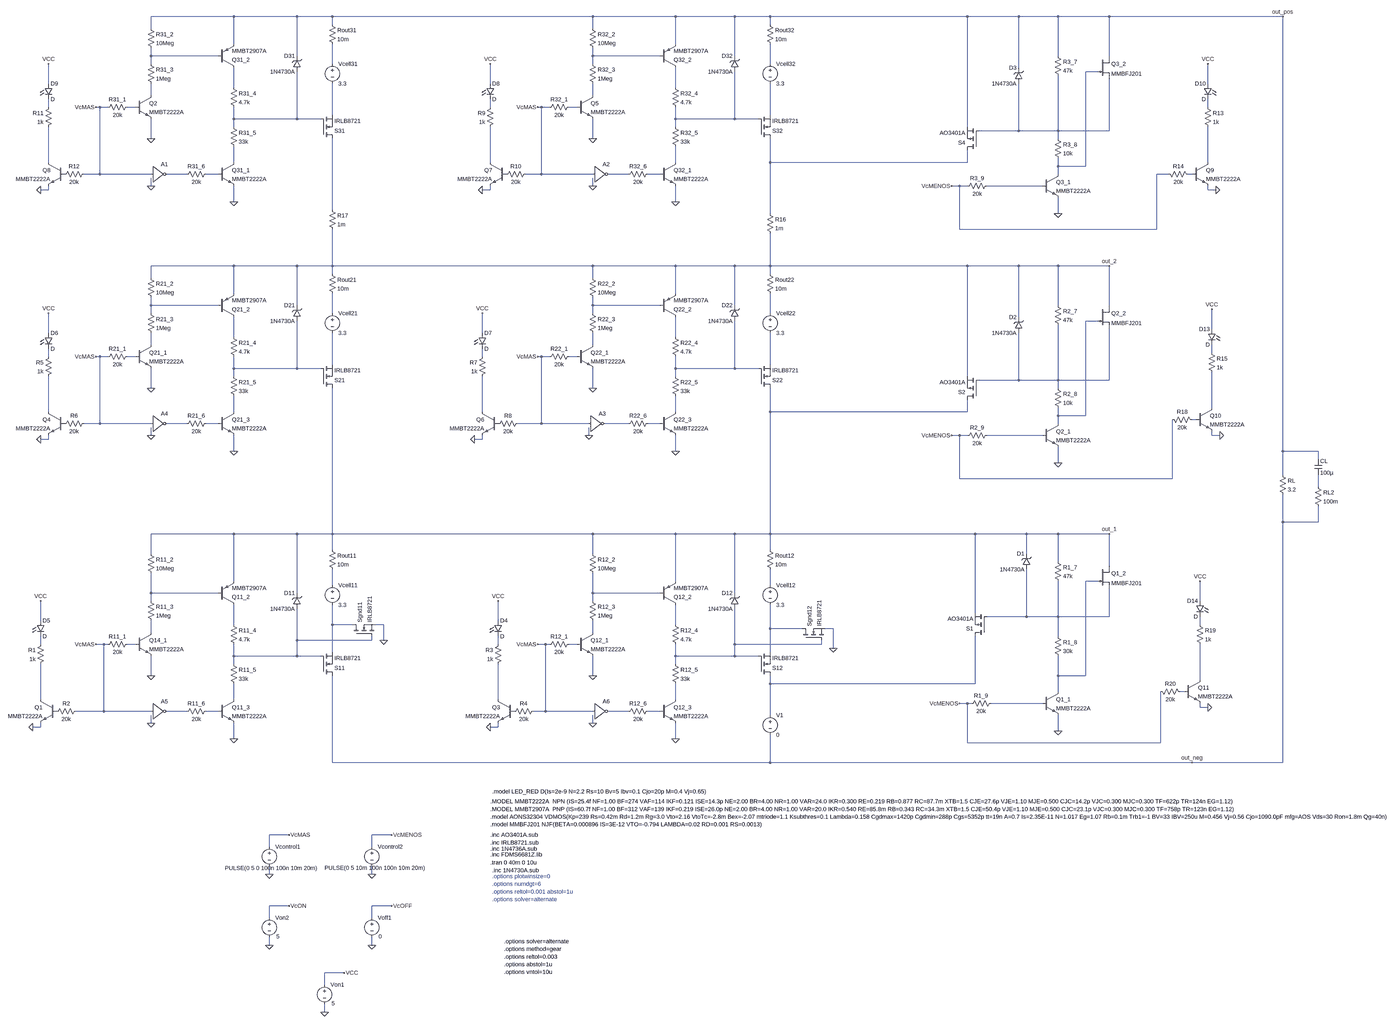
[diagram p0: schematic mas-menos-menos.asc, whole sheet]
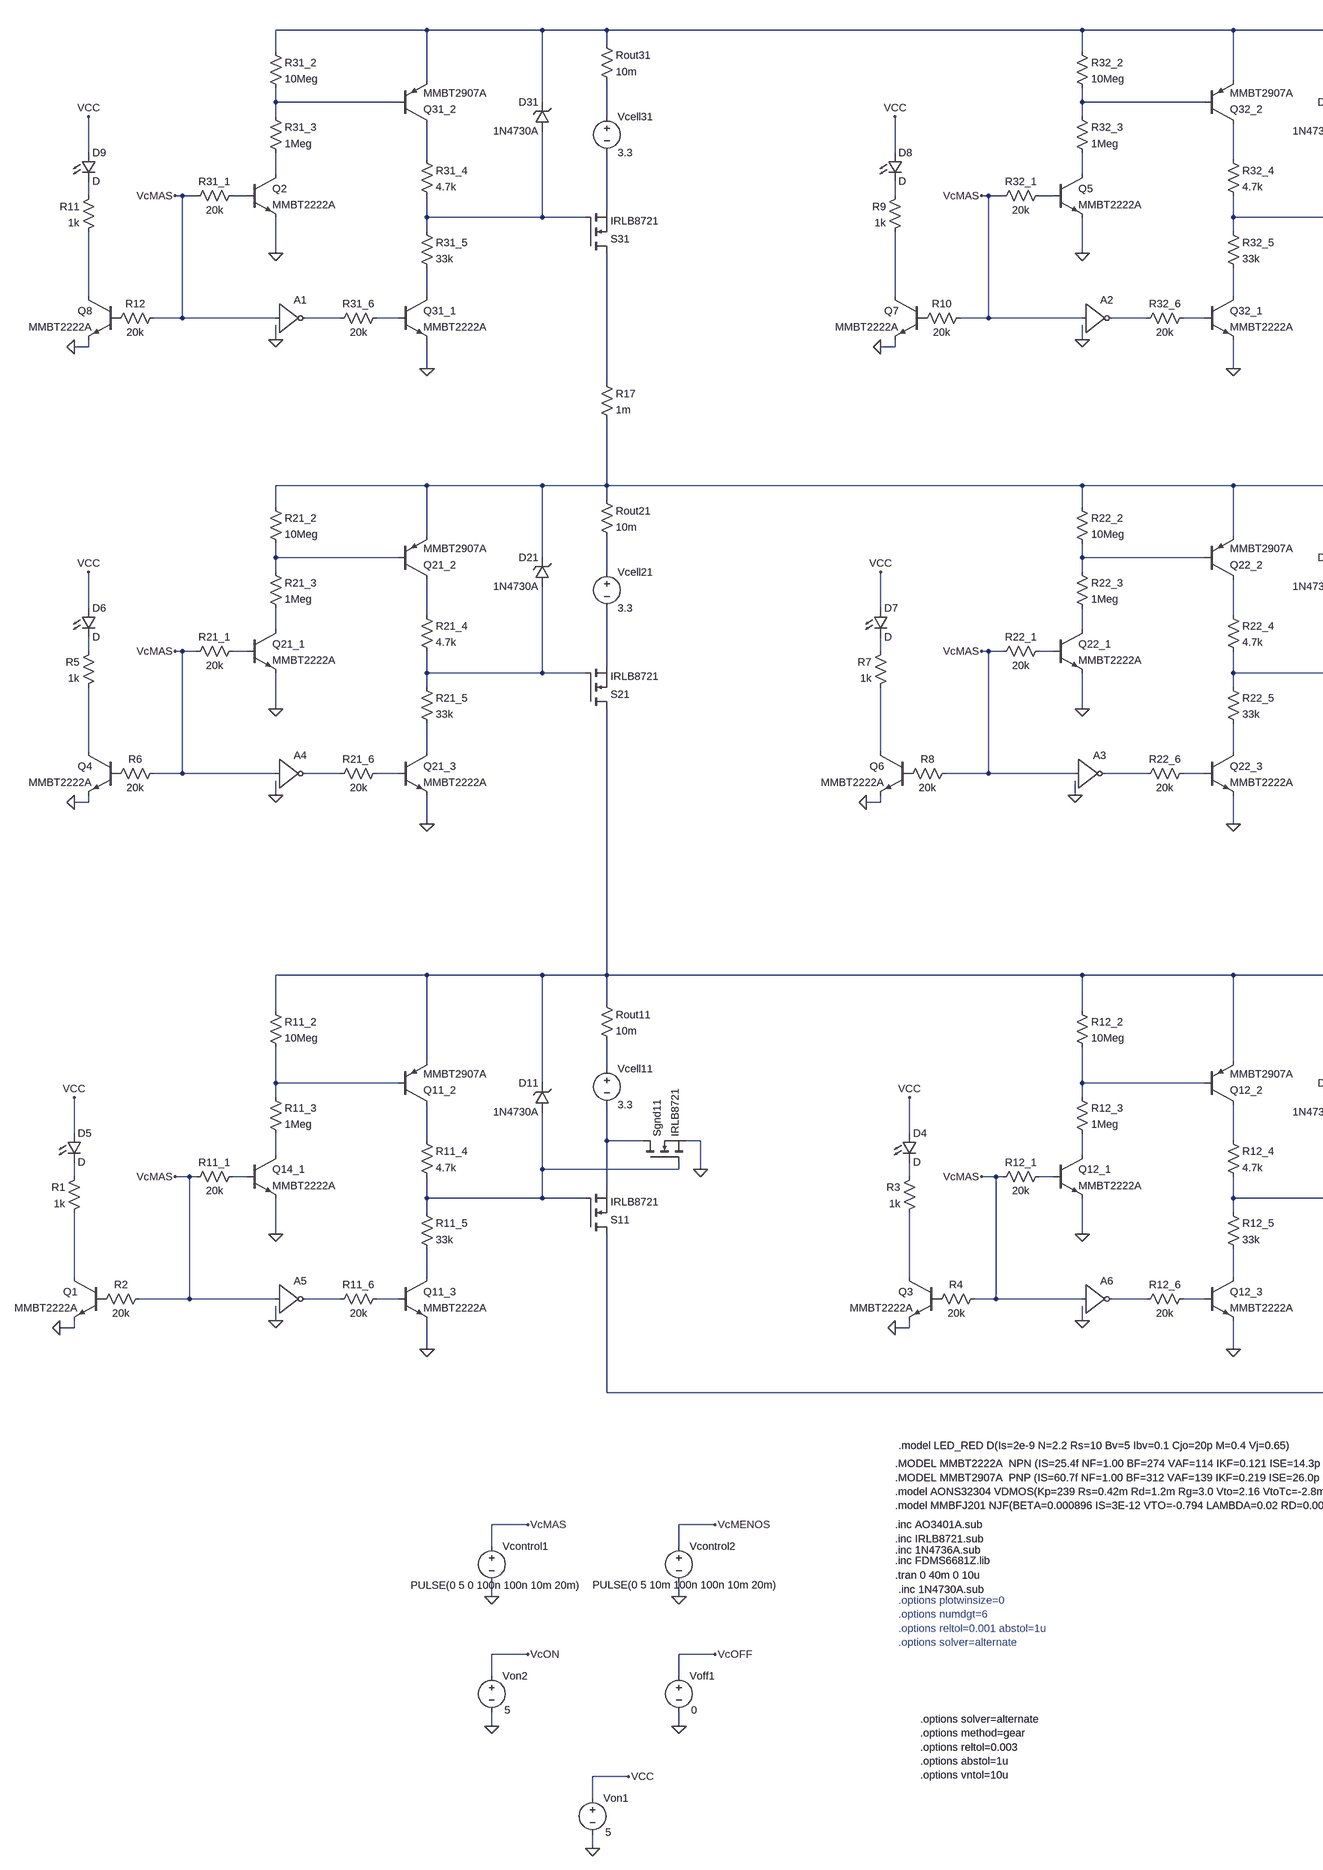
[diagram p1: schematic mas-menos-menos.asc, part, row 1 of 1, column 1 of 2]
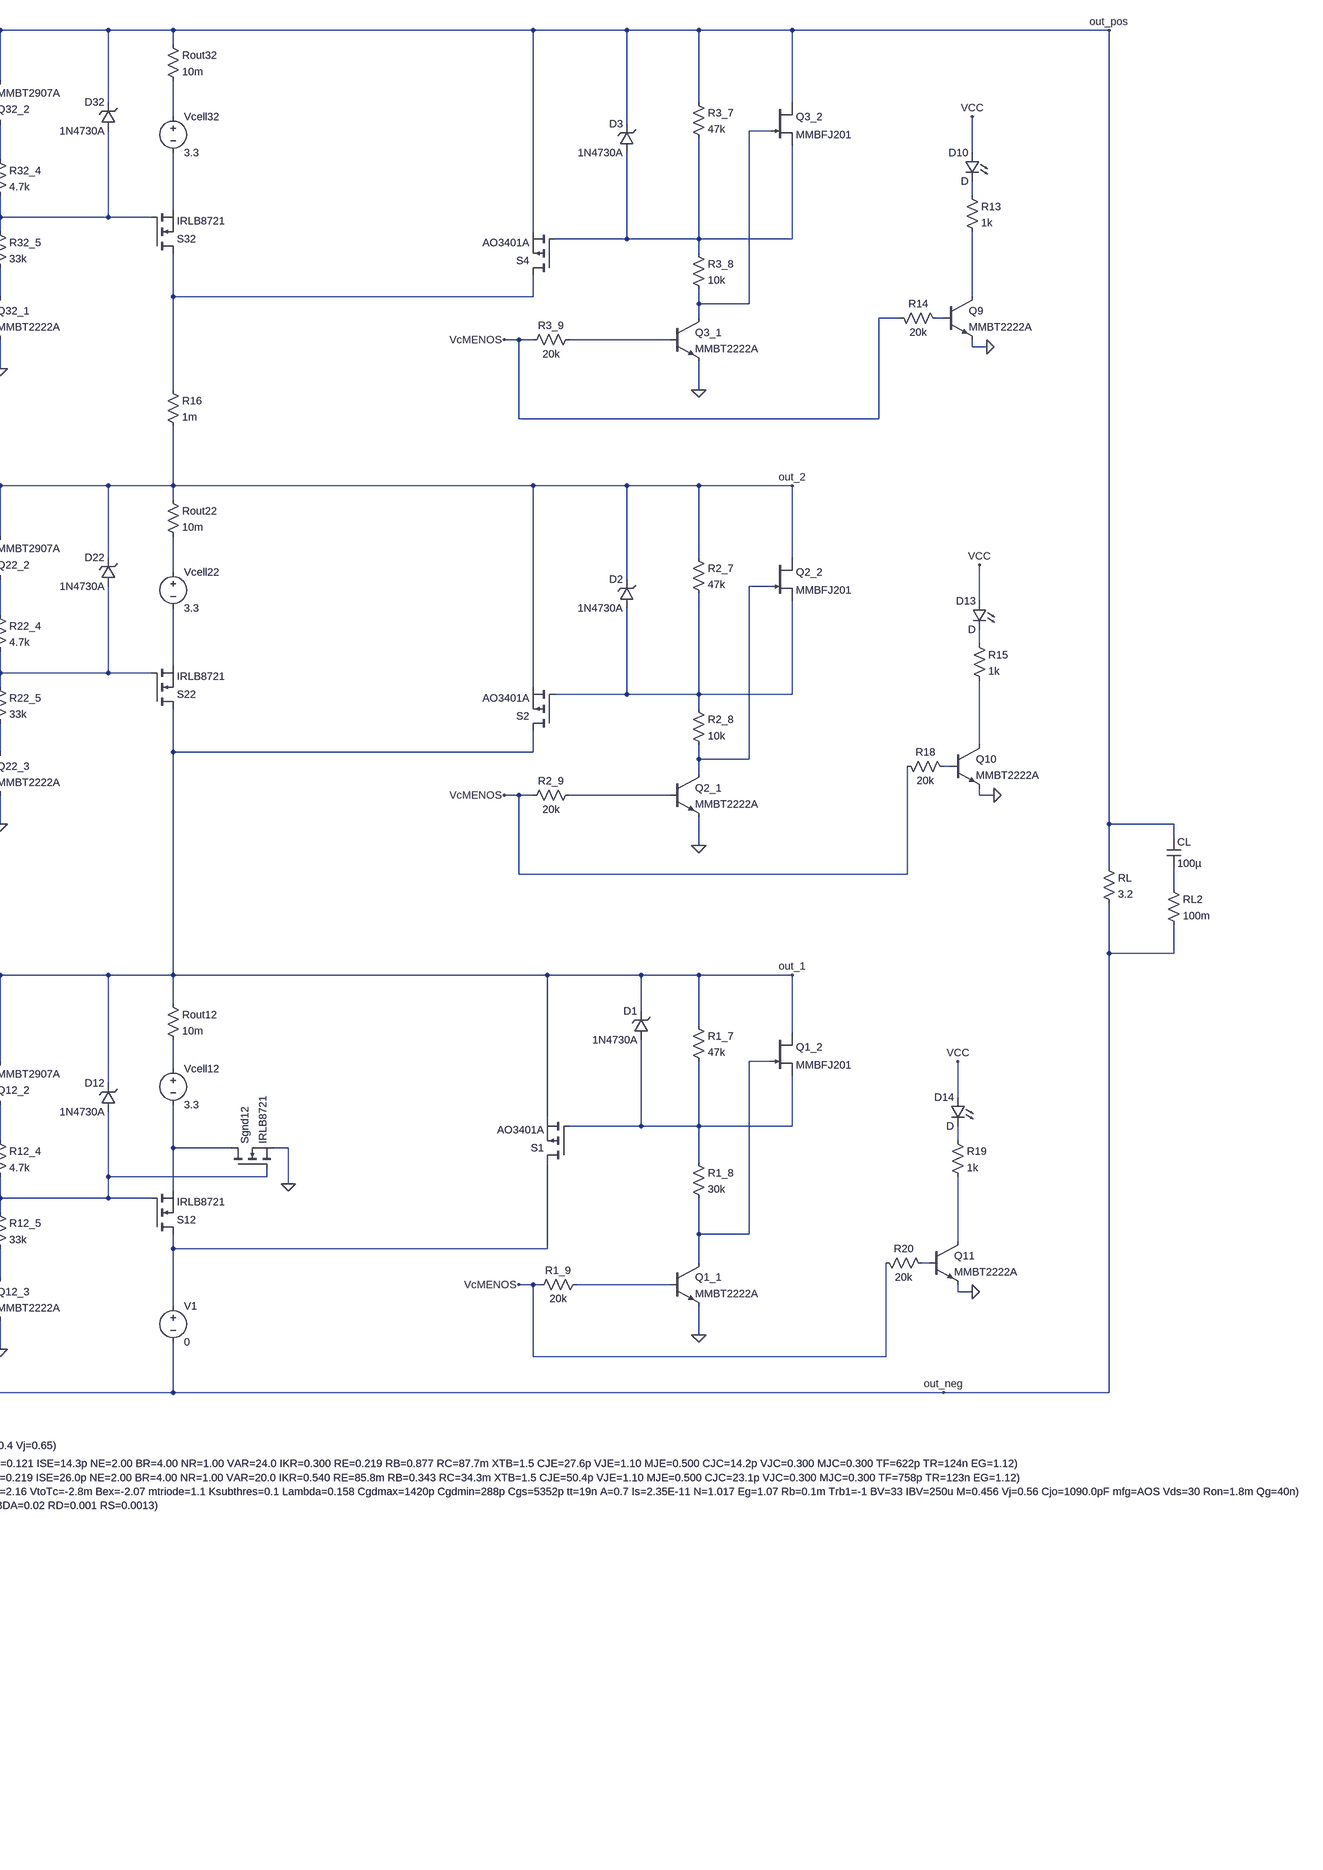
[diagram p2: schematic mas-menos-menos.asc, part, row 1 of 1, column 2 of 2]
mas-menos-menos.asc, the LTspice schematic file:
Version 4.1
SHEET 1 7672 2128
WIRE -1296 -2512 -1632 -2512
WIRE -1040 -2512 -1296 -2512
WIRE -896 -2512 -1040 -2512
WIRE 192 -2512 -896 -2512
WIRE 528 -2512 192 -2512
WIRE 768 -2512 528 -2512
WIRE 912 -2512 768 -2512
WIRE 1712 -2512 912 -2512
WIRE 1920 -2512 1712 -2512
WIRE 2080 -2512 1920 -2512
WIRE 2288 -2512 2080 -2512
WIRE 2992 -2512 2288 -2512
WIRE -896 -2480 -896 -2512
WIRE 912 -2480 912 -2512
WIRE -1632 -2464 -1632 -2512
WIRE 192 -2464 192 -2512
WIRE -1296 -2400 -1296 -2512
WIRE 528 -2400 528 -2512
WIRE -1632 -2352 -1632 -2384
WIRE -1360 -2352 -1632 -2352
WIRE -1040 -2352 -1040 -2512
WIRE 192 -2352 192 -2384
WIRE 464 -2352 192 -2352
WIRE 768 -2352 768 -2512
WIRE 2080 -2352 2080 -2512
WIRE 2288 -2352 2288 -2512
WIRE -1632 -2320 -1632 -2352
WIRE -896 -2320 -896 -2400
WIRE 192 -2320 192 -2352
WIRE 912 -2320 912 -2400
WIRE 1920 -2304 1920 -2512
WIRE 2240 -2288 2192 -2288
WIRE -2048 -2240 -2048 -2320
WIRE -224 -2240 -224 -2320
WIRE 2688 -2240 2688 -2320
WIRE -1296 -2224 -1296 -2304
WIRE 528 -2224 528 -2304
WIRE -1632 -2192 -1632 -2240
WIRE 192 -2192 192 -2240
WIRE -2048 -2144 -2048 -2176
WIRE -1840 -2144 -1856 -2144
WIRE -1808 -2144 -1840 -2144
WIRE -1696 -2144 -1728 -2144
WIRE -224 -2144 -224 -2176
WIRE -16 -2144 -32 -2144
WIRE 16 -2144 -16 -2144
WIRE 128 -2144 96 -2144
WIRE 2688 -2144 2688 -2176
WIRE -896 -2112 -896 -2240
WIRE 912 -2112 912 -2240
WIRE -1296 -2096 -1296 -2144
WIRE -1040 -2096 -1040 -2288
WIRE -1040 -2096 -1296 -2096
WIRE -944 -2096 -1040 -2096
WIRE 528 -2096 528 -2144
WIRE 768 -2096 768 -2288
WIRE 768 -2096 528 -2096
WIRE 864 -2096 768 -2096
WIRE -1296 -2064 -1296 -2096
WIRE 528 -2064 528 -2096
WIRE 1712 -2064 1712 -2512
WIRE 1920 -2048 1920 -2240
WIRE 1920 -2048 1760 -2048
WIRE 2080 -2048 2080 -2272
WIRE 2080 -2048 1920 -2048
WIRE 2288 -2048 2288 -2256
WIRE 2288 -2048 2080 -2048
WIRE -1632 -2016 -1632 -2096
WIRE 192 -2016 192 -2096
WIRE 2080 -2016 2080 -2048
WIRE -2048 -1920 -2048 -2064
WIRE -1296 -1920 -1296 -1984
WIRE -224 -1920 -224 -2064
WIRE 528 -1920 528 -1984
WIRE 912 -1920 912 -2016
WIRE 1712 -1920 1712 -1968
WIRE 1712 -1920 912 -1920
WIRE 2688 -1920 2688 -2064
WIRE 2080 -1904 2080 -1936
WIRE 2192 -1904 2192 -2288
WIRE 2192 -1904 2080 -1904
WIRE -1840 -1872 -1840 -2144
WIRE -1840 -1872 -1904 -1872
WIRE -1632 -1872 -1840 -1872
WIRE -1488 -1872 -1568 -1872
WIRE -1360 -1872 -1408 -1872
WIRE -16 -1872 -16 -2144
WIRE -16 -1872 -80 -1872
WIRE 192 -1872 -16 -1872
WIRE 336 -1872 256 -1872
WIRE 464 -1872 416 -1872
WIRE 2080 -1872 2080 -1904
WIRE 2528 -1872 2480 -1872
WIRE 2624 -1872 2608 -1872
WIRE -1632 -1824 -1632 -1856
WIRE 192 -1824 192 -1856
WIRE 1680 -1824 1648 -1824
WIRE 1712 -1824 1680 -1824
WIRE 2016 -1824 1792 -1824
WIRE -2048 -1808 -2048 -1824
WIRE -2048 -1808 -2080 -1808
WIRE -224 -1808 -224 -1824
WIRE -224 -1808 -256 -1808
WIRE 2688 -1808 2688 -1824
WIRE 2720 -1808 2688 -1808
WIRE -1296 -1760 -1296 -1824
WIRE 528 -1760 528 -1824
WIRE -896 -1728 -896 -2016
WIRE 912 -1712 912 -1920
WIRE 2080 -1712 2080 -1776
WIRE 1680 -1648 1680 -1824
WIRE 2480 -1648 2480 -1872
WIRE 2480 -1648 1680 -1648
WIRE -1296 -1456 -1632 -1456
WIRE -1040 -1456 -1296 -1456
WIRE -896 -1456 -896 -1648
WIRE -896 -1456 -1040 -1456
WIRE 192 -1456 -896 -1456
WIRE 528 -1456 192 -1456
WIRE 768 -1456 528 -1456
WIRE 912 -1456 912 -1632
WIRE 912 -1456 768 -1456
WIRE 1712 -1456 912 -1456
WIRE 1920 -1456 1712 -1456
WIRE 2080 -1456 1920 -1456
WIRE 2288 -1456 2080 -1456
WIRE -896 -1424 -896 -1456
WIRE 912 -1424 912 -1456
WIRE -1632 -1408 -1632 -1456
WIRE 192 -1408 192 -1456
WIRE -1296 -1344 -1296 -1456
WIRE 528 -1344 528 -1456
WIRE -1632 -1296 -1632 -1328
WIRE -1360 -1296 -1632 -1296
WIRE -1040 -1296 -1040 -1456
WIRE 192 -1296 192 -1328
WIRE 464 -1296 192 -1296
WIRE 768 -1296 768 -1456
WIRE 2080 -1296 2080 -1456
WIRE 2288 -1296 2288 -1456
WIRE -1632 -1264 -1632 -1296
WIRE -896 -1264 -896 -1344
WIRE 192 -1264 192 -1296
WIRE 912 -1264 912 -1344
WIRE 1920 -1248 1920 -1456
WIRE 2240 -1232 2192 -1232
WIRE 2704 -1200 2704 -1280
WIRE -2048 -1184 -2048 -1264
WIRE -256 -1184 -256 -1264
WIRE -1296 -1168 -1296 -1248
WIRE 528 -1168 528 -1248
WIRE -1632 -1136 -1632 -1184
WIRE 192 -1136 192 -1184
WIRE 2704 -1104 2704 -1136
WIRE -2048 -1088 -2048 -1120
WIRE -1840 -1088 -1856 -1088
WIRE -1808 -1088 -1840 -1088
WIRE -1696 -1088 -1728 -1088
WIRE -256 -1088 -256 -1120
WIRE -16 -1088 -32 -1088
WIRE 16 -1088 -16 -1088
WIRE 128 -1088 96 -1088
WIRE -896 -1056 -896 -1184
WIRE 912 -1056 912 -1184
WIRE -1296 -1040 -1296 -1088
WIRE -1040 -1040 -1040 -1232
WIRE -1040 -1040 -1296 -1040
WIRE -944 -1040 -1040 -1040
WIRE 528 -1040 528 -1088
WIRE 768 -1040 768 -1232
WIRE 768 -1040 528 -1040
WIRE 864 -1040 768 -1040
WIRE -1296 -1008 -1296 -1040
WIRE 528 -1008 528 -1040
WIRE 1712 -1008 1712 -1456
WIRE 1920 -992 1920 -1184
WIRE 1920 -992 1760 -992
WIRE 2080 -992 2080 -1216
WIRE 2080 -992 1920 -992
WIRE 2288 -992 2288 -1200
WIRE 2288 -992 2080 -992
WIRE -1632 -960 -1632 -1040
WIRE 192 -960 192 -1040
WIRE 2080 -960 2080 -992
WIRE 2704 -880 2704 -1024
WIRE -2048 -864 -2048 -1008
WIRE -1296 -864 -1296 -928
WIRE -256 -864 -256 -1008
WIRE 528 -864 528 -928
WIRE 912 -864 912 -960
WIRE 1712 -864 1712 -912
WIRE 1712 -864 912 -864
WIRE 2080 -848 2080 -880
WIRE 2192 -848 2192 -1232
WIRE 2192 -848 2080 -848
WIRE 2640 -832 2624 -832
WIRE -1840 -816 -1840 -1088
WIRE -1840 -816 -1904 -816
WIRE -1632 -816 -1840 -816
WIRE -1488 -816 -1568 -816
WIRE -1360 -816 -1408 -816
WIRE -16 -816 -16 -1088
WIRE -16 -816 -112 -816
WIRE 176 -816 -16 -816
WIRE 336 -816 240 -816
WIRE 464 -816 416 -816
WIRE 2080 -816 2080 -848
WIRE -1632 -768 -1632 -800
WIRE 176 -768 176 -800
WIRE 1680 -768 1648 -768
WIRE 1712 -768 1680 -768
WIRE 2016 -768 1792 -768
WIRE 2704 -768 2704 -784
WIRE 2736 -768 2704 -768
WIRE -2048 -752 -2048 -768
WIRE -2048 -752 -2080 -752
WIRE -256 -752 -256 -768
WIRE -256 -752 -288 -752
WIRE -1296 -704 -1296 -768
WIRE 528 -704 528 -768
WIRE 2992 -704 2992 -2512
WIRE 3136 -704 2992 -704
WIRE 3136 -672 3136 -704
WIRE 2080 -656 2080 -720
WIRE 2992 -608 2992 -704
WIRE 1680 -592 1680 -768
WIRE 2544 -592 2544 -832
WIRE 2544 -592 1680 -592
WIRE 3136 -560 3136 -608
WIRE 2992 -416 2992 -528
WIRE 3136 -416 3136 -480
WIRE 3136 -416 2992 -416
WIRE -1296 -368 -1632 -368
WIRE -1040 -368 -1296 -368
WIRE -896 -368 -896 -960
WIRE -896 -368 -1040 -368
WIRE 192 -368 -896 -368
WIRE 528 -368 192 -368
WIRE 768 -368 528 -368
WIRE 912 -368 912 -864
WIRE 912 -368 768 -368
WIRE 1744 -368 912 -368
WIRE 1952 -368 1744 -368
WIRE 2080 -368 1952 -368
WIRE 2288 -368 2080 -368
WIRE -896 -304 -896 -368
WIRE 912 -304 912 -368
WIRE -1632 -288 -1632 -368
WIRE 192 -288 192 -368
WIRE 1952 -288 1952 -368
WIRE 2080 -256 2080 -368
WIRE 2288 -240 2288 -368
WIRE -1296 -176 -1296 -368
WIRE 528 -176 528 -368
WIRE 2240 -176 2192 -176
WIRE -896 -160 -896 -224
WIRE 912 -160 912 -224
WIRE -1632 -128 -1632 -208
WIRE -1360 -128 -1632 -128
WIRE -1040 -128 -1040 -368
WIRE 192 -128 192 -208
WIRE 464 -128 192 -128
WIRE 768 -128 768 -368
WIRE -1632 -96 -1632 -128
WIRE 192 -96 192 -128
WIRE 2656 -96 2656 -176
WIRE 1744 -48 1744 -368
WIRE 1952 -32 1952 -224
WIRE 1952 -32 1792 -32
WIRE 2080 -32 2080 -176
WIRE 2080 -32 1952 -32
WIRE 2288 -32 2288 -144
WIRE 2288 -32 2080 -32
WIRE -2080 -16 -2080 -96
WIRE -192 -16 -192 -96
WIRE -1296 0 -1296 -80
WIRE -896 0 -896 -80
WIRE -816 0 -896 0
WIRE -688 0 -720 0
WIRE 528 0 528 -80
WIRE 2656 0 2656 -32
WIRE 912 16 912 -80
WIRE 1040 16 912 16
WIRE 1168 16 1136 16
WIRE -1632 32 -1632 -16
WIRE 192 32 192 -16
WIRE 2080 48 2080 -32
WIRE -1040 64 -1040 -64
WIRE -736 64 -736 48
WIRE -736 64 -1040 64
WIRE -688 64 -688 0
WIRE -2080 80 -2080 48
WIRE -1824 80 -1856 80
WIRE -1808 80 -1824 80
WIRE -1696 80 -1728 80
WIRE -192 80 -192 48
WIRE 0 80 -32 80
WIRE 16 80 0 80
WIRE 128 80 96 80
WIRE 768 80 768 -64
WIRE 1120 80 1120 64
WIRE 1120 80 768 80
WIRE 1168 96 1168 16
WIRE -896 112 -896 0
WIRE 912 112 912 16
WIRE -1296 128 -1296 80
WIRE -1040 128 -1040 64
WIRE -1040 128 -1296 128
WIRE -944 128 -1040 128
WIRE 528 128 528 80
WIRE 768 128 768 80
WIRE 768 128 528 128
WIRE 864 128 768 128
WIRE -1296 160 -1296 128
WIRE 528 160 528 128
WIRE -1632 208 -1632 128
WIRE 192 208 192 128
WIRE 2080 208 2080 128
WIRE 2192 208 2192 -176
WIRE 2192 208 2080 208
WIRE 2656 224 2656 80
WIRE 912 240 912 208
WIRE 1744 240 1744 48
WIRE 1744 240 912 240
WIRE 2080 272 2080 208
WIRE 2592 272 2576 272
WIRE -2080 304 -2080 160
WIRE -1296 304 -1296 240
WIRE -192 304 -192 160
WIRE 528 304 528 240
WIRE 1712 320 1680 320
WIRE 1728 320 1712 320
WIRE 2016 320 1808 320
WIRE 2656 336 2656 320
WIRE 2688 336 2656 336
WIRE -1824 352 -1824 80
WIRE -1824 352 -1936 352
WIRE -1632 352 -1824 352
WIRE -1488 352 -1568 352
WIRE -1360 352 -1408 352
WIRE 0 352 0 80
WIRE 0 352 -48 352
WIRE 192 352 0 352
WIRE 336 352 256 352
WIRE 464 352 416 352
WIRE 912 368 912 240
WIRE -1632 400 -1632 368
WIRE 192 400 192 368
WIRE -2080 416 -2080 400
WIRE -2080 416 -2112 416
WIRE -192 416 -192 400
WIRE -192 416 -224 416
WIRE 2080 432 2080 368
WIRE -1296 464 -1296 400
WIRE 528 464 528 400
WIRE 1712 480 1712 320
WIRE 2496 480 2496 272
WIRE 2496 480 1712 480
WIRE -896 560 -896 208
WIRE 912 560 912 448
WIRE 912 560 -896 560
WIRE 2624 560 912 560
WIRE 2992 560 2992 -416
WIRE 2992 560 2624 560
WIRE -1072 1024 -1152 1024
WIRE -656 1024 -736 1024
WIRE -1152 1072 -1152 1024
WIRE -736 1072 -736 1024
WIRE -1152 1184 -1152 1152
WIRE -736 1184 -736 1152
WIRE -1072 1312 -1152 1312
WIRE -656 1312 -736 1312
WIRE -1152 1360 -1152 1312
WIRE -736 1360 -736 1312
WIRE -1152 1472 -1152 1440
WIRE -736 1472 -736 1440
WIRE -848 1584 -928 1584
WIRE -928 1632 -928 1584
WIRE -928 1744 -928 1712
FLAG -1632 208 0
FLAG -1296 464 0
FLAG 192 208 0
FLAG 528 464 0
FLAG -1632 -960 0
FLAG -1296 -704 0
FLAG 192 -960 0
FLAG 528 -704 0
FLAG -1152 1184 0
FLAG -736 1184 0
FLAG -1072 1024 VcMAS
FLAG -656 1024 VcMENOS
FLAG -736 1472 0
FLAG -656 1312 VcOFF
FLAG -1152 1472 0
FLAG -1072 1312 VcON
FLAG -1856 80 VcMAS
FLAG -1856 -1088 VcMAS
FLAG -32 -1088 VcMAS
FLAG -32 80 VcMAS
FLAG 2624 560 out_neg
FLAG 2288 -368 out_1
FLAG 2080 432 0
FLAG 1680 320 VcMENOS
FLAG 2080 -656 0
FLAG 1648 -768 VcMENOS
FLAG 2992 -2512 out_pos
FLAG 1168 96 0
FLAG -688 64 0
FLAG -1632 -2016 0
FLAG -1296 -1760 0
FLAG 192 -2016 0
FLAG 528 -1760 0
FLAG -1856 -2144 VcMAS
FLAG -32 -2144 VcMAS
FLAG 2080 -1712 0
FLAG 1648 -1824 VcMENOS
FLAG -1632 -1824 0
FLAG 192 -1824 0
FLAG 176 -768 0
FLAG -1632 -768 0
FLAG -1632 400 0
FLAG 192 400 0
FLAG 2288 -1456 out_2
FLAG -2112 416 0
FLAG -224 416 0
FLAG -2080 -752 0
FLAG -288 -752 0
FLAG -256 -1808 0
FLAG -2080 -1808 0
FLAG 2720 -1808 0
FLAG 2736 -768 0
FLAG 2688 336 0
FLAG 2656 -176 VCC
FLAG -192 -96 VCC
FLAG -2080 -96 VCC
FLAG -256 -1264 VCC
FLAG -2048 -1264 VCC
FLAG 2704 -1280 VCC
FLAG 2688 -2320 VCC
FLAG -224 -2320 VCC
FLAG -2048 -2320 VCC
FLAG -928 1744 0
FLAG -848 1584 VCC
SYMBOL npn -1360 304 R0
SYMATTR InstName Q11_3
SYMATTR Value MMBT2222A
SYMBOL res -1312 144 R0
SYMATTR InstName R11_5
SYMATTR Value 33k
SYMBOL res -1312 -16 R0
SYMATTR InstName R11_4
SYMATTR Value 4.7k
SYMBOL npn -1696 32 R0
SYMATTR InstName Q14_1
SYMATTR Value MMBT2222A
SYMBOL res -1648 -112 R0
SYMATTR InstName R11_3
SYMATTR Value 1Meg
SYMBOL res -1648 -304 R0
SYMATTR InstName R11_2
SYMATTR Value 10Meg
SYMBOL res -1392 336 R90
WINDOW 0 0 56 VBottom 2
WINDOW 3 32 56 VTop 2
SYMATTR InstName R11_6
SYMATTR Value 20k
SYMBOL voltage -896 -176 R0
WINDOW 123 0 0 Left 0
WINDOW 39 0 0 Left 0
SYMATTR InstName Vcell11
SYMATTR Value 3.3
SYMBOL pnp -1360 -80 M180
SYMATTR InstName Q11_2
SYMATTR Value MMBT2907A
SYMBOL nmos -944 208 M180
SYMATTR InstName S11
SYMATTR Value IRLB8721
SYMATTR Prefix X
SYMBOL npn 464 304 R0
SYMATTR InstName Q12_3
SYMATTR Value MMBT2222A
SYMBOL res 512 144 R0
SYMATTR InstName R12_5
SYMATTR Value 33k
SYMBOL res 512 -16 R0
SYMATTR InstName R12_4
SYMATTR Value 4.7k
SYMBOL npn 128 32 R0
SYMATTR InstName Q12_1
SYMATTR Value MMBT2222A
SYMBOL res 176 -112 R0
SYMATTR InstName R12_3
SYMATTR Value 1Meg
SYMBOL res 176 -304 R0
SYMATTR InstName R12_2
SYMATTR Value 10Meg
SYMBOL res 432 336 R90
WINDOW 0 0 56 VBottom 2
WINDOW 3 32 56 VTop 2
SYMATTR InstName R12_6
SYMATTR Value 20k
SYMBOL voltage 912 -176 R0
WINDOW 123 0 0 Left 0
WINDOW 39 0 0 Left 0
SYMATTR InstName Vcell12
SYMATTR Value 3.3
SYMBOL pnp 464 -80 M180
SYMATTR InstName Q12_2
SYMATTR Value MMBT2907A
SYMBOL nmos 864 208 M180
SYMATTR InstName S12
SYMATTR Value IRLB8721
SYMATTR Prefix X
SYMBOL npn -1360 -864 R0
SYMATTR InstName Q21_3
SYMATTR Value MMBT2222A
SYMBOL res -1312 -1024 R0
SYMATTR InstName R21_5
SYMATTR Value 33k
SYMBOL res -1312 -1184 R0
SYMATTR InstName R21_4
SYMATTR Value 4.7k
SYMBOL npn -1696 -1136 R0
SYMATTR InstName Q21_1
SYMATTR Value MMBT2222A
SYMBOL res -1648 -1280 R0
SYMATTR InstName R21_3
SYMATTR Value 1Meg
SYMBOL res -1648 -1424 R0
SYMATTR InstName R21_2
SYMATTR Value 10Meg
SYMBOL res -1392 -832 R90
WINDOW 0 0 56 VBottom 2
WINDOW 3 32 56 VTop 2
SYMATTR InstName R21_6
SYMATTR Value 20k
SYMBOL voltage -896 -1280 R0
WINDOW 123 0 0 Left 0
WINDOW 39 0 0 Left 0
SYMATTR InstName Vcell21
SYMATTR Value 3.3
SYMBOL pnp -1360 -1248 M180
SYMATTR InstName Q21_2
SYMATTR Value MMBT2907A
SYMBOL nmos -944 -960 M180
SYMATTR InstName S21
SYMATTR Value IRLB8721
SYMATTR Prefix X
SYMBOL npn 464 -864 R0
SYMATTR InstName Q22_3
SYMATTR Value MMBT2222A
SYMBOL res 512 -1024 R0
SYMATTR InstName R22_5
SYMATTR Value 33k
SYMBOL res 512 -1184 R0
SYMATTR InstName R22_4
SYMATTR Value 4.7k
SYMBOL npn 128 -1136 R0
SYMATTR InstName Q22_1
SYMATTR Value MMBT2222A
SYMBOL res 176 -1280 R0
SYMATTR InstName R22_3
SYMATTR Value 1Meg
SYMBOL res 176 -1424 R0
SYMATTR InstName R22_2
SYMATTR Value 10Meg
SYMBOL res 432 -832 R90
WINDOW 0 0 56 VBottom 2
WINDOW 3 32 56 VTop 2
SYMATTR InstName R22_6
SYMATTR Value 20k
SYMBOL voltage 912 -1280 R0
WINDOW 123 0 0 Left 0
WINDOW 39 0 0 Left 0
SYMATTR InstName Vcell22
SYMATTR Value 3.3
SYMBOL pnp 464 -1248 M180
SYMATTR InstName Q22_2
SYMATTR Value MMBT2907A
SYMBOL nmos 864 -960 M180
SYMATTR InstName S22
SYMATTR Value IRLB8721
SYMATTR Prefix X
SYMBOL voltage -1152 1056 R0
WINDOW 3 -180 103 Left 2
WINDOW 123 0 0 Left 0
WINDOW 39 0 0 Left 0
SYMATTR Value PULSE(0 5 0 100n 100n 10m 20m)
SYMATTR InstName Vcontrol1
SYMBOL voltage -736 1056 R0
WINDOW 3 -192 102 Left 2
WINDOW 123 0 0 Left 0
WINDOW 39 0 0 Left 0
SYMATTR Value PULSE(0 5 10m 100n 100n 10m 20m)
SYMATTR InstName Vcontrol2
SYMBOL res -1712 64 R90
WINDOW 0 0 56 VBottom 2
WINDOW 3 32 56 VTop 2
SYMATTR InstName R11_1
SYMATTR Value 20k
SYMBOL res -1712 -1104 R90
WINDOW 0 0 56 VBottom 2
WINDOW 3 32 56 VTop 2
SYMATTR InstName R21_1
SYMATTR Value 20k
SYMBOL res 112 -1104 R90
WINDOW 0 0 56 VBottom 2
WINDOW 3 32 56 VTop 2
SYMATTR InstName R22_1
SYMATTR Value 20k
SYMBOL res 112 64 R90
WINDOW 0 0 56 VBottom 2
WINDOW 3 32 56 VTop 2
SYMATTR InstName R12_1
SYMATTR Value 20k
SYMBOL res 2976 -624 R0
SYMATTR InstName RL
SYMATTR Value 3.2
SYMBOL res 896 -320 R0
SYMATTR InstName Rout12
SYMATTR Value 10m
SYMBOL res -912 -320 R0
SYMATTR InstName Rout11
SYMATTR Value 10m
SYMBOL res -912 -1440 R0
SYMATTR InstName Rout21
SYMATTR Value 10m
SYMBOL res 896 -1440 R0
SYMATTR InstName Rout22
SYMATTR Value 10m
SYMBOL npn 2016 272 R0
SYMATTR InstName Q1_1
SYMATTR Value MMBT2222A
SYMBOL res 1824 304 R90
WINDOW 0 0 56 VBottom 2
WINDOW 3 32 56 VTop 2
SYMATTR InstName R1_9
SYMATTR Value 20k
SYMBOL res 2064 -272 R0
SYMATTR InstName R1_7
SYMATTR Value 47k
SYMBOL npn 2016 -816 R0
SYMATTR InstName Q2_1
SYMATTR Value MMBT2222A
SYMBOL res 1808 -784 R90
WINDOW 0 0 56 VBottom 2
WINDOW 3 32 56 VTop 2
SYMATTR InstName R2_9
SYMATTR Value 20k
SYMBOL res 2064 -1312 R0
SYMATTR InstName R2_7
SYMATTR Value 47k
SYMBOL njf 2240 -240 R0
SYMATTR InstName Q1_2
SYMATTR Value MMBFJ201
SYMBOL njf 2240 -1296 R0
SYMATTR InstName Q2_2
SYMATTR Value MMBFJ201
SYMBOL zener 1936 -1184 R180
WINDOW 0 24 64 Left 2
WINDOW 3 24 0 Left 2
SYMATTR InstName D2
SYMATTR Value 1N4730A
SYMATTR Prefix x
SYMBOL zener 784 -1232 R180
WINDOW 0 24 64 Left 2
WINDOW 3 24 0 Left 2
SYMATTR InstName D22
SYMATTR Value 1N4730A
SYMATTR Prefix X
SYMBOL zener -1024 -1232 R180
WINDOW 0 24 64 Left 2
WINDOW 3 24 0 Left 2
SYMATTR InstName D21
SYMATTR Value 1N4730A
SYMATTR Prefix X
SYMBOL zener -1024 -64 R180
WINDOW 0 24 64 Left 2
WINDOW 3 24 0 Left 2
SYMATTR InstName D11
SYMATTR Value 1N4730A
SYMATTR Prefix X
SYMBOL zener 784 -64 R180
WINDOW 0 24 64 Left 2
WINDOW 3 24 0 Left 2
SYMATTR InstName D12
SYMATTR Value 1N4730A
SYMATTR Prefix X
SYMBOL zener 1968 -224 R180
WINDOW 0 24 64 Left 2
WINDOW 3 24 0 Left 2
SYMATTR InstName D1
SYMATTR Value 1N4730A
SYMATTR Prefix x
SYMBOL cap 3120 -672 R0
SYMATTR InstName CL
SYMATTR Value 100µ
SYMBOL res 3120 -576 R0
SYMATTR InstName RL2
SYMATTR Value 100m
SYMBOL nmos -816 48 R270
SYMATTR InstName Sgnd11
SYMATTR Value IRLB8721
SYMATTR Prefix X
SYMBOL nmos 1040 64 R270
SYMATTR InstName Sgnd12
SYMATTR Value IRLB8721
SYMATTR Prefix X
SYMBOL npn -1360 -1920 R0
SYMATTR InstName Q31_1
SYMATTR Value MMBT2222A
SYMBOL res -1312 -2080 R0
SYMATTR InstName R31_5
SYMATTR Value 33k
SYMBOL res -1312 -2240 R0
SYMATTR InstName R31_4
SYMATTR Value 4.7k
SYMBOL npn -1696 -2192 R0
SYMATTR InstName Q2
SYMATTR Value MMBT2222A
SYMBOL res -1648 -2336 R0
SYMATTR InstName R31_3
SYMATTR Value 1Meg
SYMBOL res -1648 -2480 R0
SYMATTR InstName R31_2
SYMATTR Value 10Meg
SYMBOL res -1392 -1888 R90
WINDOW 0 0 56 VBottom 2
WINDOW 3 32 56 VTop 2
SYMATTR InstName R31_6
SYMATTR Value 20k
SYMBOL voltage -896 -2336 R0
WINDOW 123 0 0 Left 0
WINDOW 39 0 0 Left 0
SYMATTR InstName Vcell31
SYMATTR Value 3.3
SYMBOL pnp -1360 -2304 M180
SYMATTR InstName Q31_2
SYMATTR Value MMBT2907A
SYMBOL nmos -944 -2016 M180
SYMATTR InstName S31
SYMATTR Value IRLB8721
SYMATTR Prefix X
SYMBOL npn 464 -1920 R0
SYMATTR InstName Q32_1
SYMATTR Value MMBT2222A
SYMBOL res 512 -2080 R0
SYMATTR InstName R32_5
SYMATTR Value 33k
SYMBOL res 512 -2240 R0
SYMATTR InstName R32_4
SYMATTR Value 4.7k
SYMBOL npn 128 -2192 R0
SYMATTR InstName Q5
SYMATTR Value MMBT2222A
SYMBOL res 176 -2336 R0
SYMATTR InstName R32_3
SYMATTR Value 1Meg
SYMBOL res 176 -2480 R0
SYMATTR InstName R32_2
SYMATTR Value 10Meg
SYMBOL res 432 -1888 R90
WINDOW 0 0 56 VBottom 2
WINDOW 3 32 56 VTop 2
SYMATTR InstName R32_6
SYMATTR Value 20k
SYMBOL voltage 912 -2336 R0
WINDOW 123 0 0 Left 0
WINDOW 39 0 0 Left 0
SYMATTR InstName Vcell32
SYMATTR Value 3.3
SYMBOL pnp 464 -2304 M180
SYMATTR InstName Q32_2
SYMATTR Value MMBT2907A
SYMBOL nmos 864 -2016 M180
SYMATTR InstName S32
SYMATTR Value IRLB8721
SYMATTR Prefix X
SYMBOL res -1712 -2160 R90
WINDOW 0 0 56 VBottom 2
WINDOW 3 32 56 VTop 2
SYMATTR InstName R31_1
SYMATTR Value 20k
SYMBOL res 112 -2160 R90
WINDOW 0 0 56 VBottom 2
WINDOW 3 32 56 VTop 2
SYMATTR InstName R32_1
SYMATTR Value 20k
SYMBOL res -912 -2496 R0
SYMATTR InstName Rout31
SYMATTR Value 10m
SYMBOL res 896 -2496 R0
SYMATTR InstName Rout32
SYMATTR Value 10m
SYMBOL npn 2016 -1872 R0
SYMATTR InstName Q3_1
SYMATTR Value MMBT2222A
SYMBOL res 1808 -1840 R90
WINDOW 0 0 56 VBottom 2
WINDOW 3 32 56 VTop 2
SYMATTR InstName R3_9
SYMATTR Value 20k
SYMBOL res 2064 -2368 R0
SYMATTR InstName R3_7
SYMATTR Value 47k
SYMBOL njf 2240 -2352 R0
SYMATTR InstName Q3_2
SYMATTR Value MMBFJ201
SYMBOL zener 1936 -2240 R180
WINDOW 0 24 64 Left 2
WINDOW 3 24 0 Left 2
SYMATTR InstName D3
SYMATTR Value 1N4730A
SYMATTR Prefix x
SYMBOL zener 784 -2288 R180
WINDOW 0 24 64 Left 2
WINDOW 3 24 0 Left 2
SYMATTR InstName D32
SYMATTR Value 1N4730A
SYMATTR Prefix X
SYMBOL zener -1024 -2288 R180
WINDOW 0 24 64 Left 2
WINDOW 3 24 0 Left 2
SYMATTR InstName D31
SYMATTR Value 1N4730A
SYMATTR Prefix X
SYMBOL res 896 -1728 R0
SYMATTR InstName R16
SYMATTR Value 1m
SYMBOL res -912 -1744 R0
SYMATTR InstName R17
SYMATTR Value 1m
SYMBOL Digital\\inv -1632 -1936 R0
SYMATTR InstName A1
SYMBOL Digital\\inv 192 -1936 R0
SYMATTR InstName A2
SYMBOL Digital\\inv 176 -880 R0
SYMATTR InstName A3
SYMBOL Digital\\inv -1632 -880 R0
SYMATTR InstName A4
SYMBOL Digital\\inv -1632 288 R0
SYMATTR InstName A5
SYMBOL Digital\\inv 192 288 R0
SYMATTR InstName A6
SYMBOL pmos 1760 -1968 R180
SYMATTR InstName S4
SYMATTR Value AO3401A
SYMATTR Prefix X
SYMBOL pmos 1760 -912 R180
SYMATTR InstName S2
SYMATTR Value AO3401A
SYMATTR Prefix X
SYMBOL pmos 1792 48 R180
SYMATTR InstName S1
SYMATTR Value AO3401A
SYMATTR Prefix X
SYMBOL voltage 912 352 R0
WINDOW 123 0 0 Left 0
WINDOW 39 0 0 Left 0
SYMATTR InstName V1
SYMATTR Value 0
SYMBOL npn -2016 304 M0
SYMATTR InstName Q1
SYMATTR Value MMBT2222A
SYMBOL res -2064 64 M0
SYMATTR InstName R1
SYMATTR Value 1k
SYMBOL res -1920 336 R90
WINDOW 0 0 56 VBottom 2
WINDOW 3 32 56 VTop 2
SYMATTR InstName R2
SYMATTR Value 20k
SYMBOL LED -2096 -16 R0
SYMATTR InstName D5
SYMBOL npn -128 304 M0
SYMATTR InstName Q3
SYMATTR Value MMBT2222A
SYMBOL res -176 64 M0
SYMATTR InstName R3
SYMATTR Value 1k
SYMBOL res -32 336 R90
WINDOW 0 0 56 VBottom 2
WINDOW 3 32 56 VTop 2
SYMATTR InstName R4
SYMATTR Value 20k
SYMBOL LED -208 -16 R0
SYMATTR InstName D4
SYMBOL npn -1984 -864 M0
SYMATTR InstName Q4
SYMATTR Value MMBT2222A
SYMBOL res -2032 -1104 M0
SYMATTR InstName R5
SYMATTR Value 1k
SYMBOL res -1888 -832 R90
WINDOW 0 0 56 VBottom 2
WINDOW 3 32 56 VTop 2
SYMATTR InstName R6
SYMATTR Value 20k
SYMBOL LED -2064 -1184 R0
SYMATTR InstName D6
SYMBOL npn -192 -864 M0
SYMATTR InstName Q6
SYMATTR Value MMBT2222A
SYMBOL res -240 -1104 M0
SYMATTR InstName R7
SYMATTR Value 1k
SYMBOL res -96 -832 R90
WINDOW 0 0 56 VBottom 2
WINDOW 3 32 56 VTop 2
SYMATTR InstName R8
SYMATTR Value 20k
SYMBOL LED -272 -1184 R0
SYMATTR InstName D7
SYMBOL npn -160 -1920 M0
SYMATTR InstName Q7
SYMATTR Value MMBT2222A
SYMBOL res -208 -2160 M0
SYMATTR InstName R9
SYMATTR Value 1k
SYMBOL res -64 -1888 R90
WINDOW 0 0 56 VBottom 2
WINDOW 3 32 56 VTop 2
SYMATTR InstName R10
SYMATTR Value 20k
SYMBOL LED -240 -2240 R0
SYMATTR InstName D8
SYMBOL npn -1984 -1920 M0
SYMATTR InstName Q8
SYMATTR Value MMBT2222A
SYMBOL res -2032 -2160 M0
SYMATTR InstName R11
SYMATTR Value 1k
SYMBOL res -1888 -1888 R90
WINDOW 0 0 56 VBottom 2
WINDOW 3 32 56 VTop 2
SYMATTR InstName R12
SYMATTR Value 20k
SYMBOL LED -2064 -2240 R0
SYMATTR InstName D9
SYMBOL npn 2624 -1920 R0
SYMATTR InstName Q9
SYMATTR Value MMBT2222A
SYMBOL res 2672 -2160 R0
SYMATTR InstName R13
SYMATTR Value 1k
SYMBOL res 2512 -1888 M90
WINDOW 0 0 56 VBottom 2
WINDOW 3 32 56 VTop 2
SYMATTR InstName R14
SYMATTR Value 20k
SYMBOL LED 2704 -2240 M0
SYMATTR InstName D10
SYMBOL npn 2640 -880 R0
SYMATTR InstName Q10
SYMATTR Value MMBT2222A
SYMBOL res 2688 -1120 R0
SYMATTR InstName R15
SYMATTR Value 1k
SYMBOL res 2528 -848 M90
WINDOW 0 0 56 VBottom 2
WINDOW 3 32 56 VTop 2
SYMATTR InstName R18
SYMATTR Value 20k
SYMBOL LED 2720 -1200 M0
SYMATTR InstName D13
SYMBOL npn 2592 224 R0
SYMATTR InstName Q11
SYMATTR Value MMBT2222A
SYMBOL res 2640 -16 R0
SYMATTR InstName R19
SYMATTR Value 1k
SYMBOL res 2480 256 M90
WINDOW 0 0 56 VBottom 2
WINDOW 3 32 56 VTop 2
SYMATTR InstName R20
SYMATTR Value 20k
SYMBOL LED 2672 -96 M0
SYMATTR InstName D14
SYMBOL res 2064 32 R0
SYMATTR InstName R1_8
SYMATTR Value 30k
SYMBOL res 2064 -976 R0
SYMATTR InstName R2_8
SYMATTR Value 10k
SYMBOL res 2064 -2032 R0
SYMATTR InstName R3_8
SYMATTR Value 10k
SYMBOL voltage -928 1616 R0
WINDOW 3 28 92 Left 2
WINDOW 123 0 0 Left 0
WINDOW 39 0 0 Left 0
SYMATTR Value 5
SYMATTR InstName Von1
SYMBOL voltage -1152 1344 R0
WINDOW 3 28 92 Left 2
WINDOW 123 0 0 Left 0
WINDOW 39 0 0 Left 0
SYMATTR Value 5
SYMATTR InstName Von2
SYMBOL voltage -736 1344 R0
WINDOW 3 27 92 Left 2
WINDOW 123 0 0 Left 0
WINDOW 39 0 0 Left 0
SYMATTR Value 0
SYMATTR InstName Voff1
TEXT -224 1136 Left 2 !.tran 0 40m 0 10u
TEXT -224 888 Left 2 !.MODEL MMBT2222A  NPN (IS=25.4f NF=1.00 BF=274 VAF=114 IKF=0.121 ISE=14.3p NE=2.00 BR=4.00 NR=1.00 VAR=24.0 IKR=0.300 RE=0.219 RB=0.877 RC=87.7m XTB=1.5 CJE=27.6p VJE=1.10 MJE=0.500 CJC=14.2p VJC=0.300 MJC=0.300 TF=622p TR=124n EG=1.12)\n.MODEL MMBT2907A  PNP (IS=60.7f NF=1.00 BF=312 VAF=139 IKF=0.219 ISE=26.0p NE=2.00 BR=4.00 NR=1.00 VAR=20.0 IKR=0.540 RE=85.8m RB=0.343 RC=34.3m XTB=1.5 CJE=50.4p VJE=1.10 MJE=0.500 CJC=23.1p VJC=0.300 MJC=0.300 TF=758p TR=123n EG=1.12)\n.model AONS32304 VDMOS(Kp=239 Rs=0.42m Rd=1.2m Rg=3.0 Vto=2.16 VtoTc=-2.8m Bex=-2.07 mtriode=1.1 Ksubthres=0.1 Lambda=0.158 Cgdmax=1420p Cgdmin=288p Cgs=5352p tt=19n A=0.7 Is=2.35E-11 N=1.017 Eg=1.07 Rb=0.1m Trb1=-1 BV=33 IBV=250u M=0.456 Vj=0.56 Cjo=1090.0pF mfg=AOS Vds=30 Ron=1.8m Qg=40n)\n.model MMBFJ201 NJF(BETA=0.000896 IS=3E-12 VTO=-0.794 LAMBDA=0.02 RD=0.001 RS=0.0013)
TEXT -224 1024 Left 2 !.inc AO3401A.sub\n.inc IRLB8721.sub
TEXT -224 1080 Left 2 !.inc 1N4736A.sub
TEXT -216 1192 Left 2 ;.options plotwinsize=0\n.options numdgt=6\n.options reltol=0.001 abstol=1u\n.options solver=alternate
TEXT -224 1104 Left 2 !.inc FDMS6681Z.lib
TEXT -216 1168 Left 2 !.inc 1N4730A.sub
TEXT -216 848 Left 2 !.model LED_RED D(Is=2e-9 N=2.2 Rs=10 Bv=5 Ibv=0.1 Cjo=20p M=0.4 Vj=0.65)
TEXT -168 1456 Left 2 !.options solver=alternate\n.options method=gear\n.options reltol=0.003\n.options abstol=1u\n.options vntol=10u

The netlist it stands for:
* mas-menos-menos.asc
Q11_3 N087 N092 0 0 MMBT2222A
R11_5 N077 N087 33k
R11_4 N070 N077 4.7k
Q14_1 N075 N079 0 0 MMBT2222A
R11_3 N067 N075 1Meg
R11_2 out_1 N067 10Meg
R11_6 N092 N091 20k
Vcell11 N065 N071 3.3
Q11_2 N070 N067 out_1 0 MMBT2907A
X§S11 out_neg N077 N071 IRLB8721  ; pins D G S
Q12_3 N089 N094 0 0 MMBT2222A
R12_5 N082 N089 33k
R12_4 N072 N082 4.7k
Q12_1 N076 N081 0 0 MMBT2222A
R12_3 N068 N076 1Meg
R12_2 out_1 N068 10Meg
R12_6 N094 N093 20k
Vcell12 N066 N074 3.3
Q12_2 N072 N068 out_1 0 MMBT2907A
X§S12 N084 N082 N074 IRLB8721  ; pins D G S
Q21_3 N054 N059 0 0 MMBT2222A
R21_5 N049 N054 33k
R21_4 N038 N049 4.7k
Q21_1 N040 N044 0 0 MMBT2222A
R21_3 N033 N040 1Meg
R21_2 out_2 N033 10Meg
R21_6 N059 N058 20k
Vcell21 N035 N047 3.3
Q21_2 N038 N033 out_2 0 MMBT2907A
X§S21 out_1 N049 N047 IRLB8721  ; pins D G S
Q22_3 N056 N061 0 0 MMBT2222A
R22_5 N050 N056 33k
R22_4 N039 N050 4.7k
Q22_1 N041 N046 0 0 MMBT2222A
R22_3 N034 N041 1Meg
R22_2 out_2 N034 10Meg
R22_6 N061 N060 20k
Vcell22 N036 N048 3.3
Q22_2 N039 N034 out_2 0 MMBT2907A
X§S22 out_1 N050 N048 IRLB8721  ; pins D G S
Vcontrol1 VcMAS 0 PULSE(0 5 0 100n 100n 10m 20m)
Vcontrol2 VcMENOS 0 PULSE(0 5 10m 100n 100n 10m 20m)
R11_1 N079 VcMAS 20k
R21_1 N044 VcMAS 20k
R22_1 N046 VcMAS 20k
R12_1 N081 VcMAS 20k
RL out_pos out_neg 3.2
Rout12 out_1 N066 10m
Rout11 out_1 N065 10m
Rout21 out_2 N035 10m
Rout22 out_2 N036 10m
Q1_1 N064 N090 0 0 MMBT2222A
R1_9 N090 VcMENOS 20k
R1_7 out_1 N069 47k
Q2_1 N037 N062 0 0 MMBT2222A
R2_9 N062 VcMENOS 20k
R2_7 out_2 N051 47k
J§Q1_2 out_1 N064 N069 MMBFJ201
J§Q2_2 out_2 N037 N051 MMBFJ201
X§D2 N051 out_2 1N4730A  ; pins + -
X§D22 N050 out_2 1N4730A  ; pins + -
X§D21 N049 out_2 1N4730A  ; pins + -
X§D11 N077 out_1 1N4730A  ; pins + -
X§D12 N082 out_1 1N4730A  ; pins + -
X§D1 N069 out_1 1N4730A  ; pins + -
CL out_pos N063 100µ
RL2 N063 out_neg 100m
X§Sgnd11 N071 N077 0 IRLB8721  ; pins D G S
X§Sgnd12 N074 N082 0 IRLB8721  ; pins D G S
Q31_1 N021 N027 0 0 MMBT2222A
R31_5 N017 N021 33k
R31_4 N006 N017 4.7k
Q2 N008 N011 0 0 MMBT2222A
R31_3 N001 N008 1Meg
R31_2 out_pos N001 10Meg
R31_6 N027 N026 20k
Vcell31 N003 N015 3.3
Q31_2 N006 N001 out_pos 0 MMBT2907A
X§S31 N032 N017 N015 IRLB8721  ; pins D G S
Q32_1 N023 N029 0 0 MMBT2222A
R32_5 N018 N023 33k
R32_4 N007 N018 4.7k
Q5 N009 N013 0 0 MMBT2222A
R32_3 N002 N009 1Meg
R32_2 out_pos N002 10Meg
R32_6 N029 N028 20k
Vcell32 N004 N016 3.3
Q32_2 N007 N002 out_pos 0 MMBT2907A
X§S32 N024 N018 N016 IRLB8721  ; pins D G S
R31_1 N011 VcMAS 20k
R32_1 N013 VcMAS 20k
Rout31 out_pos N003 10m
Rout32 out_pos N004 10m
Q3_1 N005 N031 0 0 MMBT2222A
R3_9 N031 VcMENOS 20k
R3_7 out_pos N019 47k
J§Q3_2 out_pos N005 N019 MMBFJ201
X§D3 N019 out_pos 1N4730A  ; pins + -
X§D32 N018 out_pos 1N4730A  ; pins + -
X§D31 N017 out_pos 1N4730A  ; pins + -
R16 N024 out_2 1m
R17 N032 out_2 1m
A1 VcMAS 0 0 0 0 N026 0 0 BUF
A2 VcMAS 0 0 0 0 N028 0 0 BUF
A3 VcMAS 0 0 0 0 N060 0 0 BUF
A4 VcMAS 0 0 0 0 N058 0 0 BUF
A5 VcMAS 0 0 0 0 N091 0 0 BUF
A6 VcMAS 0 0 0 0 N093 0 0 BUF
X§S4 N024 N019 out_pos AO3401A  ; pins D G S
X§S2 out_1 N051 out_2 AO3401A  ; pins D G S
X§S1 N084 N069 out_1 AO3401A  ; pins D G S
V1 N084 out_neg 0
Q1 N086 P001 0 0 MMBT2222A
R1 N078 N086 1k
R2 VcMAS P001 20k
D5 VCC N078 D
Q3 N088 P002 0 0 MMBT2222A
R3 N080 N088 1k
R4 VcMAS P002 20k
D4 VCC N080 D
Q4 N053 P003 0 0 MMBT2222A
R5 N043 N053 1k
R6 VcMAS P003 20k
D6 VCC N043 D
Q6 N055 P004 0 0 MMBT2222A
R7 N045 N055 1k
R8 VcMAS P004 20k
D7 VCC N045 D
Q7 N022 P005 0 0 MMBT2222A
R9 N012 N022 1k
R10 VcMAS P005 20k
D8 VCC N012 D
Q8 N020 P006 0 0 MMBT2222A
R11 N010 N020 1k
R12 VcMAS P006 20k
D9 VCC N010 D
Q9 N025 N030 0 0 MMBT2222A
R13 N014 N025 1k
R14 VcMENOS N030 20k
D10 VCC N014 D
Q10 N052 N057 0 0 MMBT2222A
R15 N042 N052 1k
R18 VcMENOS N057 20k
D13 VCC N042 D
Q11 N083 N085 0 0 MMBT2222A
R19 N073 N083 1k
R20 VcMENOS N085 20k
D14 VCC N073 D
R1_8 N069 N064 30k
R2_8 N051 N037 10k
R3_8 N019 N005 10k
Von1 VCC 0 5
Von2 VcON 0 5
Voff1 VcOFF 0 0
.model D D
.lib standard.dio
.model NPN NPN
.model PNP PNP
.lib standard.bjt
.model NJF NJF
.model PJF PJF
.lib standard.jft
.tran 0 40m 0 10u
.MODEL MMBT2222A  NPN (IS=25.4f NF=1.00 BF=274 VAF=114 IKF=0.121 ISE=14.3p NE=2.00 BR=4.00 NR=1.00 VAR=24.0 IKR=0.300 RE=0.219 RB=0.877 RC=87.7m XTB=1.5 CJE=27.6p VJE=1.10 MJE=0.500 CJC=14.2p VJC=0.300 MJC=0.300 TF=622p TR=124n EG=1.12)
.MODEL MMBT2907A  PNP (IS=60.7f NF=1.00 BF=312 VAF=139 IKF=0.219 ISE=26.0p NE=2.00 BR=4.00 NR=1.00 VAR=20.0 IKR=0.540 RE=85.8m RB=0.343 RC=34.3m XTB=1.5 CJE=50.4p VJE=1.10 MJE=0.500 CJC=23.1p VJC=0.300 MJC=0.300 TF=758p TR=123n EG=1.12)
.model AONS32304 VDMOS(Kp=239 Rs=0.42m Rd=1.2m Rg=3.0 Vto=2.16 VtoTc=-2.8m Bex=-2.07 mtriode=1.1 Ksubthres=0.1 Lambda=0.158 Cgdmax=1420p Cgdmin=288p Cgs=5352p tt=19n A=0.7 Is=2.35E-11 N=1.017 Eg=1.07 Rb=0.1m Trb1=-1 BV=33 IBV=250u M=0.456 Vj=0.56 Cjo=1090.0pF mfg=AOS Vds=30 Ron=1.8m Qg=40n)
.model MMBFJ201 NJF(BETA=0.000896 IS=3E-12 VTO=-0.794 LAMBDA=0.02 RD=0.001 RS=0.0013)
.inc AO3401A.sub
.inc IRLB8721.sub
.inc 1N4736A.sub
* .options plotwinsize=0
* .options numdgt=6
* .options reltol=0.001 abstol=1u
* .options solver=alternate
.inc FDMS6681Z.lib
.inc 1N4730A.sub
.model LED_RED D(Is=2e-9 N=2.2 Rs=10 Bv=5 Ibv=0.1 Cjo=20p M=0.4 Vj=0.65)
.options solver=alternate
.options method=gear
.options reltol=0.003
.options abstol=1u
.options vntol=10u
.backanno
.end